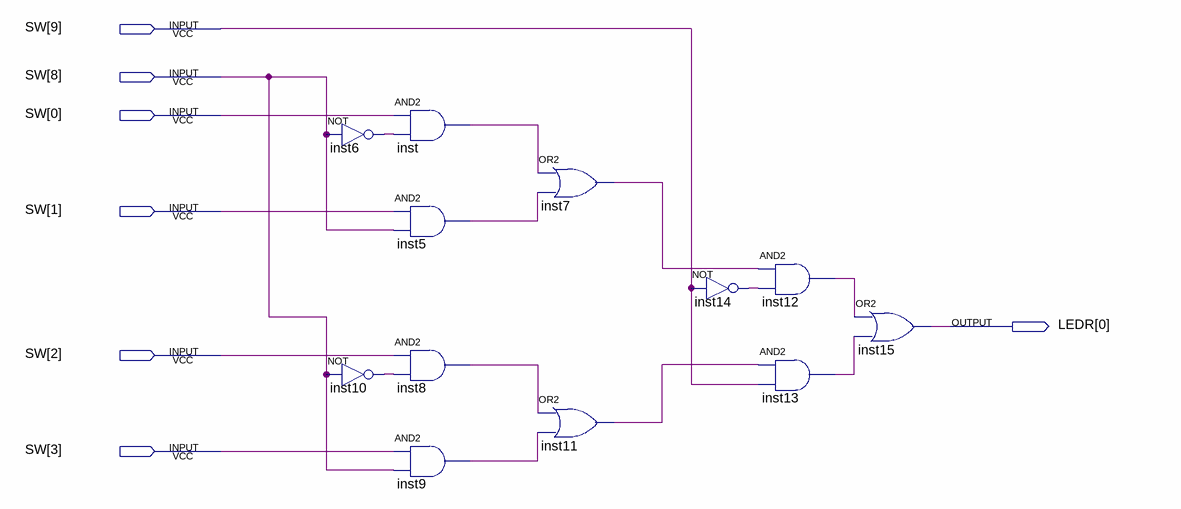
[diagram p0: schematic sheet]
// Quartus schematic mux4to1.bdf as structural Verilog: 12 symbols, 7 pins
module mux4to1 (
  input  [9:0] SW,
  output [0:0] LEDR
);

  wire inst5_out, inst6_out, inst7_out, inst8_out, inst9_out, inst10_out, inst11_out, inst12_out, inst13_out,
       inst14_out, inst_out;

  not inst6 (inst6_out, SW[8]);
  not inst10 (inst10_out, SW[8]);
  and inst (inst_out, SW[0], inst6_out);
  and inst5 (inst5_out, SW[1], SW[8]);
  and inst8 (inst8_out, SW[2], inst10_out);
  and inst9 (inst9_out, SW[3], SW[8]);
  or inst7 (inst7_out, inst_out, inst5_out);
  or inst11 (inst11_out, inst8_out, inst9_out);
  and inst12 (inst12_out, inst7_out, inst14_out);
  not inst14 (inst14_out, SW[9]);
  and inst13 (inst13_out, inst11_out, SW[9]);
  or inst15 (LEDR[0], inst12_out, inst13_out);
endmodule
